# EAGLE schematic SigGenerator (EAGLE 9.2.2)

## Sheet 1 of 2
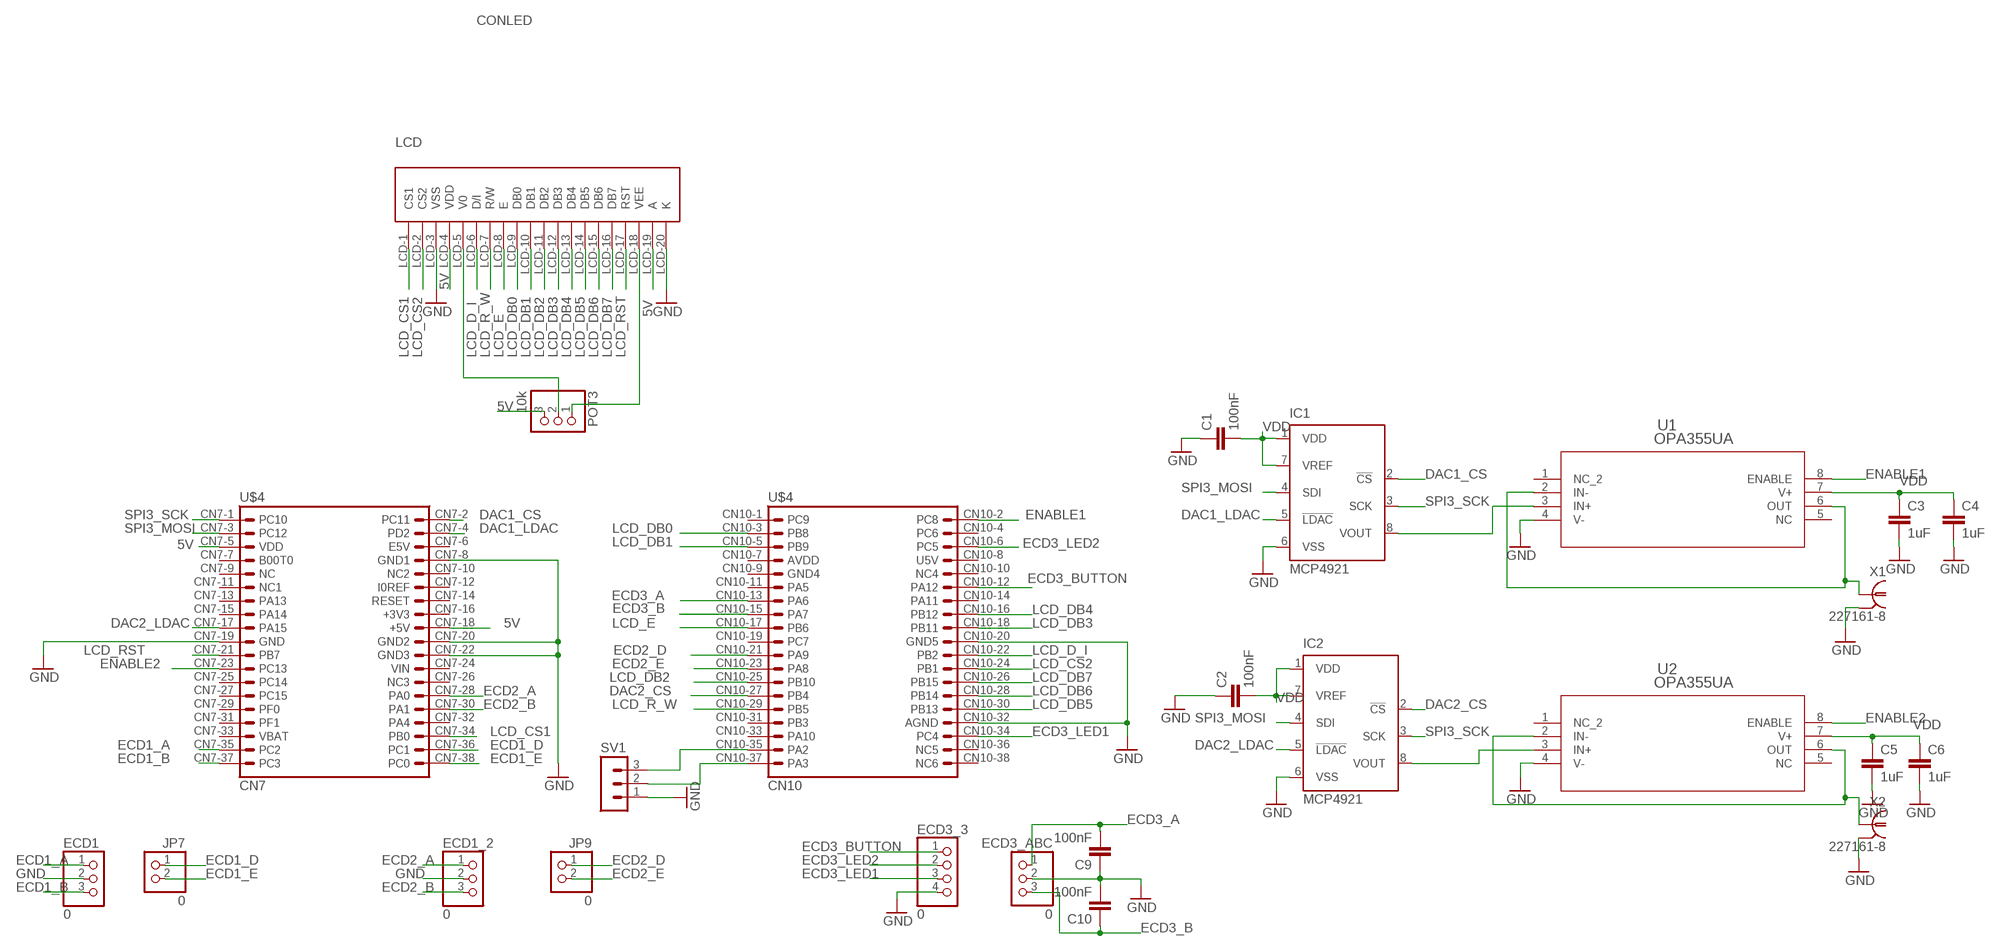
[diagram p0: schematic, sheet 1]

### Parts
C1  100nF  C2,5-3  [C2.5-3]
C2  100nF  C2,5-3  [C2.5-3]
C3  1uF  C2,5-3  [C2.5-3]
C4  1uF  C2,5-3  [C2.5-3]
C5  1uF  C2,5-3  [C2.5-3]
C6  1uF  C2,5-3  [C2.5-3]
C9  100nF  C2,5-3  [C2.5-3]
C10  100nF  C2,5-3  [C2.5-3]
ECD1  0  PINHD-1X3  [1X03]
ECD1_2  0  PINHD-1X3  [1X03]
ECD3_3  0  PINHD-1X4  [1X04]
ECD3_ABC  0  PINHD-1X3  [1X03]
IC1  MCP4921  [DIL8]
IC2  MCP4921  [DIL8]
JP7  0  PINHD-1X2  [1X02]
JP9  0  PINHD-1X2  [1X02]
LCD  CONLED  [CONLCD]
POT3  10k  PINHD-1X3  [1X03]
SV1  MA03-1  [MA03-1]
U1  OPA355UA  [D8]
U2  OPA355UA  [D8]
U$4  STM_MORPHO  [STM]
X1  227161-8  [AMP_227161]
X2  227161-8  [AMP_227161]

### Nets
5V: LCD.LCD-4(VDD) LCD.LCD-19(A) POT3.3 U$4.CN7-5(VDD) U$4.CN7-18(+5V)
DAC1_CS: IC1.2(!CS) U$4.CN7-2(PC11)
DAC1_LDAC: IC1.5(!LDAC) U$4.CN7-4(PD2)
DAC2_CS: IC2.2(!CS) U$4.CN10-27(PB4)
DAC2_LDAC: IC2.5(!LDAC) U$4.CN7-17(PA15)
ECD1_A: ECD1.1 U$4.CN7-35(PC2)
ECD1_B: ECD1.3 U$4.CN7-37(PC3)
ECD1_D: JP7.1 U$4.CN7-36(PC1)
ECD1_E: JP7.2 U$4.CN7-38(PC0)
ECD2_A: ECD1_2.1 U$4.CN7-28(PA0)
ECD2_B: ECD1_2.3 U$4.CN7-30(PA1)
ECD2_D: JP9.1 U$4.CN10-21(PA9)
ECD2_E: JP9.2 U$4.CN10-23(PA8)
ECD3_A: C9.2 ECD3_ABC.1 U$4.CN10-13(PA6)
ECD3_B: C10.1 ECD3_ABC.3 U$4.CN10-15(PA7)
ECD3_BUTTON: ECD3_3.1 U$4.CN10-12(PA12)
ECD3_LED1: ECD3_3.3 U$4.CN10-34(PC4)
ECD3_LED2: ECD3_3.2 U$4.CN10-6(PC5)
ENABLE1: U1.8(ENABLE) U$4.CN10-2(PC8)
ENABLE2: U2.8(ENABLE) U$4.CN7-23(PC13)
GND: C1.1 C2.1 C3.2 C4.2 C5.2 C6.2 C9.1 C10.2 ECD1.2 ECD1_2.2 ECD3_3.4 ECD3_ABC.2 IC1.6(VSS) IC2.6(VSS) LCD.LCD-3(VSS) LCD.LCD-20(K) SV1.1 U1.4(V-) U2.4(V-) U$4.CN7-8(GND1) U$4.CN7-19(GND) U$4.CN7-20(GND2) U$4.CN7-22(GND3) U$4.CN10-20(GND5) U$4.CN10-32(AGND) X1.2 X2.2
LCD_CS1: LCD.LCD-1(CS1) U$4.CN7-34(PB0)
LCD_CS2: LCD.LCD-2(CS2) U$4.CN10-24(PB1)
LCD_D_I: LCD.LCD-6(D/I) U$4.CN10-22(PB2)
LCD_DB0: LCD.LCD-9(DB0) U$4.CN10-3(PB8)
LCD_DB1: LCD.LCD-10(DB1) U$4.CN10-5(PB9)
LCD_DB2: LCD.LCD-11(DB2) U$4.CN10-25(PB10)
LCD_DB3: LCD.LCD-12(DB3) U$4.CN10-18(PB11)
LCD_DB4: LCD.LCD-13(DB4) U$4.CN10-16(PB12)
LCD_DB5: LCD.LCD-14(DB5) U$4.CN10-30(PB13)
LCD_DB6: LCD.LCD-15(DB6) U$4.CN10-28(PB14)
LCD_DB7: LCD.LCD-16(DB7) U$4.CN10-26(PB15)
LCD_E: LCD.LCD-8(E) U$4.CN10-17(PB6)
LCD_R_W: LCD.LCD-7(R/W) U$4.CN10-29(PB5)
LCD_RST: LCD.LCD-17(RST) U$4.CN7-21(PB7)
N$1: U2.2(IN-) U2.6(OUT) X2.1
N$2: SV1.3 U$4.CN10-35(PA2)
N$3: U1.2(IN-) U1.6(OUT) X1.1
N$4: SV1.2 U$4.CN10-37(PA3)
N$5: LCD.LCD-5(V0) POT3.2
N$6: LCD.LCD-18(VEE) POT3.1
N$7: IC1.8(VOUT) U1.3(IN+)
N$8: IC2.8(VOUT) U2.3(IN+)
SPI3_MOSI: IC1.4(SDI) IC2.4(SDI) U$4.CN7-3(PC12)
SPI3_SCK: IC1.3(SCK) IC2.3(SCK) U$4.CN7-1(PC10)
VDD: C1.2 C2.2 C3.1 C4.1 C5.1 C6.1 IC1.1(VDD) IC1.7(VREF) IC2.1(VDD) IC2.7(VREF) U1.7(V+) U2.7(V+)
Unconnected: U1.1(NC_2) U1.5(NC) U2.1(NC_2) U2.5(NC) U$4.CN7-6(E5V) U$4.CN7-7(B00T0) U$4.CN7-9(NC) U$4.CN7-10(NC2) U$4.CN7-11(NC1) U$4.CN7-12(I0REF) U$4.CN7-13(PA13) U$4.CN7-14(RESET) U$4.CN7-15(PA14) U$4.CN7-16(+3V3) U$4.CN7-24(VIN) U$4.CN7-25(PC14) U$4.CN7-26(NC3) U$4.CN7-27(PC15) U$4.CN7-29(PF0) U$4.CN7-31(PF1) U$4.CN7-32(PA4) U$4.CN7-33(VBAT) U$4.CN10-1(PC9) U$4.CN10-4(PC6) U$4.CN10-7(AVDD) U$4.CN10-8(U5V) U$4.CN10-9(GND4) U$4.CN10-10(NC4) U$4.CN10-11(PA5) U$4.CN10-14(PA11) U$4.CN10-19(PC7) U$4.CN10-31(PB3) U$4.CN10-33(PA10) U$4.CN10-36(NC5) U$4.CN10-38(NC6)

## Sheet 2 of 2
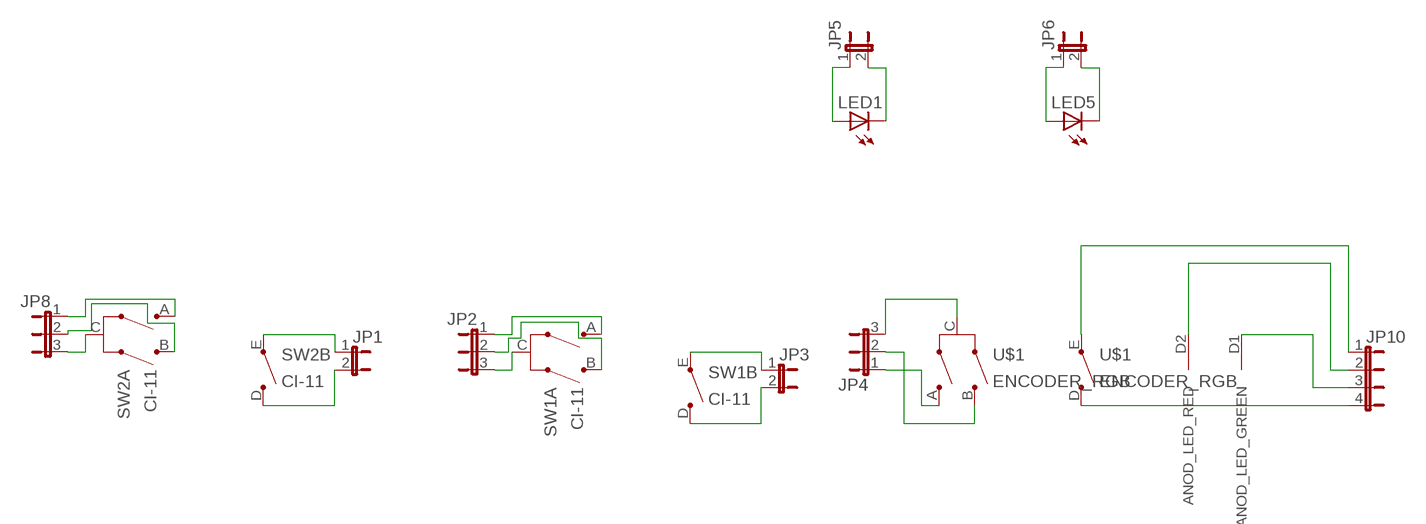
[diagram p1: schematic, sheet 2]

### Parts
JP1  JP1E  [JP1]
JP2  JP2E  [JP2]
JP3  JP1E  [JP1]
JP4  JP2E  [JP2]
JP5  JP1E  [JP1]
JP6  JP1E  [JP1]
JP8  JP2E  [JP2]
JP10  JP4E  [JP4]
LED1  LEDSQR2X5  [LED2X5]
LED5  LEDSQR2X5  [LED2X5]
SW1  CI-11  [CI-11]
SW2  CI-11  [CI-11]
U$1  ENCODER_RGB  [ENCODER_RGB]

### Nets
A: JP8.1 SW2.A(A:A)
A2: JP2.1 SW1.A(A:A)
A3: JP4.1 U$1.A
B3: JP4.2 U$1.B
GND1: JP8.3 SW2.C(A:C)
GND3: JP1.2 JP2.3 JP3.2 JP4.3 JP10.4 SW1.C(A:C) SW1.D(B:D) SW2.D(B:D) U$1.C U$1.D
LED_GREEN: JP10.3 U$1.D1(ANOD_LED_GREEN)
LED_RED: JP10.2 U$1.D2(ANOD_LED_RED)
N$10: JP8.2 SW2.B(A:B)
N$11: JP2.2 SW1.B(A:B)
N$16: JP5.1 LED1.A
N$17: JP5.2 LED1.K(C)
N$18: JP6.1 LED5.A
N$19: JP6.2 LED5.K(C)
S: JP10.1 U$1.E
SW1: JP1.1 SW2.E(B:E)
SW2: JP3.1 SW1.E(B:E)

## Library data of the parts
C1-C6 C9 C10 = capacitor-wima:C: CAPACITOR naming: grid - package width
ECD1 ECD1_2 ECD3_ABC POT3 = pinhead:PINHD-1X3: PIN HEADER
ECD3_3 = pinhead:PINHD-1X4: PIN HEADER
IC1 IC2 = microchip:MCP4921: 2.7V Dual Channel 12-Bit A/D Converter with SPI Serial Interface Source: http://ww1.microchip.com/downloads/en/DeviceDoc/21034D.pdf
JP1 JP3 JP5 JP6 = jumper:JP1E: JUMPER
JP2 JP4 JP8 = jumper:JP2E: JUMPER
JP7 JP9 = pinhead:PINHD-1X2: PIN HEADER
JP10 = jumper:JP4E: JUMPER
LCD = ddd:CONLED
LED1 LED5 = led:LED: LED OSRAM: - CHIPLED LG R971, LG N971, LY N971, LG Q971, LY Q971, LO R971, LY R971 LH N974, LH R974 LS Q976, LO Q976, LY Q976 LO Q996 - Hyper CHIPLED LW Q18S LB Q993, LB Q99A, LB R99A - SideLED LS A670, LO A670, LY A670, LG A670, LP A670 LB A673, LV A673, LT A673, LW A673 LH A674 LY A675 LS A676, LA A676, LO A676, LY A676, LW A676 LS A679, LY A679, LG A679 - Hyper Micro SIDELED® LS Y876, LA Y876, LO Y876, LY Y876 LT Y87S - SmartLED LW L88C, LW L88S LB L89C, LB L89S, LG L890 LS L89K, LO L89K, LY L89K LS L896, LA L896, LO L896, LY L896 - TOPLED LS T670, LO T670, LY T670, LG T670, LP T670 LSG T670, LSP T670, LSY T670, LOP T670, LYG T670 LG T671, LOG T671, LSG T671 LB T673, LV T673, LT T673, LW T673 LH T674 LS T676, LA T676, LO T676, LY T676, LB T676, LH T676, LSB T676, LW T676 LB T67C, LV T67C, LT T67C, LS T67K, LO T67K, LY T67K, LW E67C LS E67B, LA E67B, LO E67B, LY E67B, LB E67C, LV E67C, LT E67C LW T67C LS T679, LY T679, LG T679 LS T770, LO T770, LY T770, LG T770, LP T770 LB T773, LV T773, LT T773, LW T773 LH T774 LS E675, LA E675, LY E675, LS T675 LS T776, LA T776, LO T776, LY T776, LB T776 LHGB T686 LT T68C, LB T68C - Hyper Mini TOPLED® LB M676 - Mini TOPLED Santana® LG M470 LS M47K, LO M47K, LY M47K Source: http://www.osram.convergy.de LUXEON: - LUMILED® LXK2-PW12-R00, LXK2-PW12-S00, LXK2-PW14-U00, LXK2-PW14-V00 LXK2-PM12-R00, LXK2-PM12-S00, LXK2-PM14-U00 LXK2-PE12-Q00, LXK2-PE12-R00, LXK2-PE12-S00, LXK2-PE14-T00, LXK2-PE14-U00 LXK2-PB12-K00, LXK2-PB12-L00, LXK2-PB12-M00, LXK2-PB14-N00, LXK2-PB14-P00, LXK2-PB14-Q00 LXK2-PR12-L00, LXK2-PR12-M00, LXK2-PR14-Q00, LXK2-PR14-R00 LXK2-PD12-Q00, LXK2-PD12-R00, LXK2-PD12-S00 LXK2-PH12-R00, LXK2-PH12-S00 LXK2-PL12-P00, LXK2-PL12-Q00, LXK2-PL12-R00 Source: www.luxeon.com KINGBRIGHT: KA-3528ASYC Source: www.kingbright.com
SV1 = con-lstb:MA03-1: PIN HEADER; OC_FARNELL: unknown; OC_NEWARK: unknown
SW1 SW2 = piher:CI-11: 11mm Incemental Encoder Source: www.piher.net .. 04-CI-11v04.pdf; OC_FARNELL: unknown; OC_NEWARK: unknown
U1 U2 = opa355:OPA355UA; MANUFACTURER_PART_NUMBER: OPA355UA; VENDOR: Texas Instruments
U$1 = piher:ENCODER_RGB
U$4 = stm32:STM_MORPHO
X1 X2 = con-coax:?227161*: JACK, RIGHT ANGLE, 50 OHM, PCB, BNC Source: amp_227161.pdf; OC_FARNELL: unknown; OC_NEWARK: unknown